# EAGLE schematic tracker (EAGLE 6.5.0)
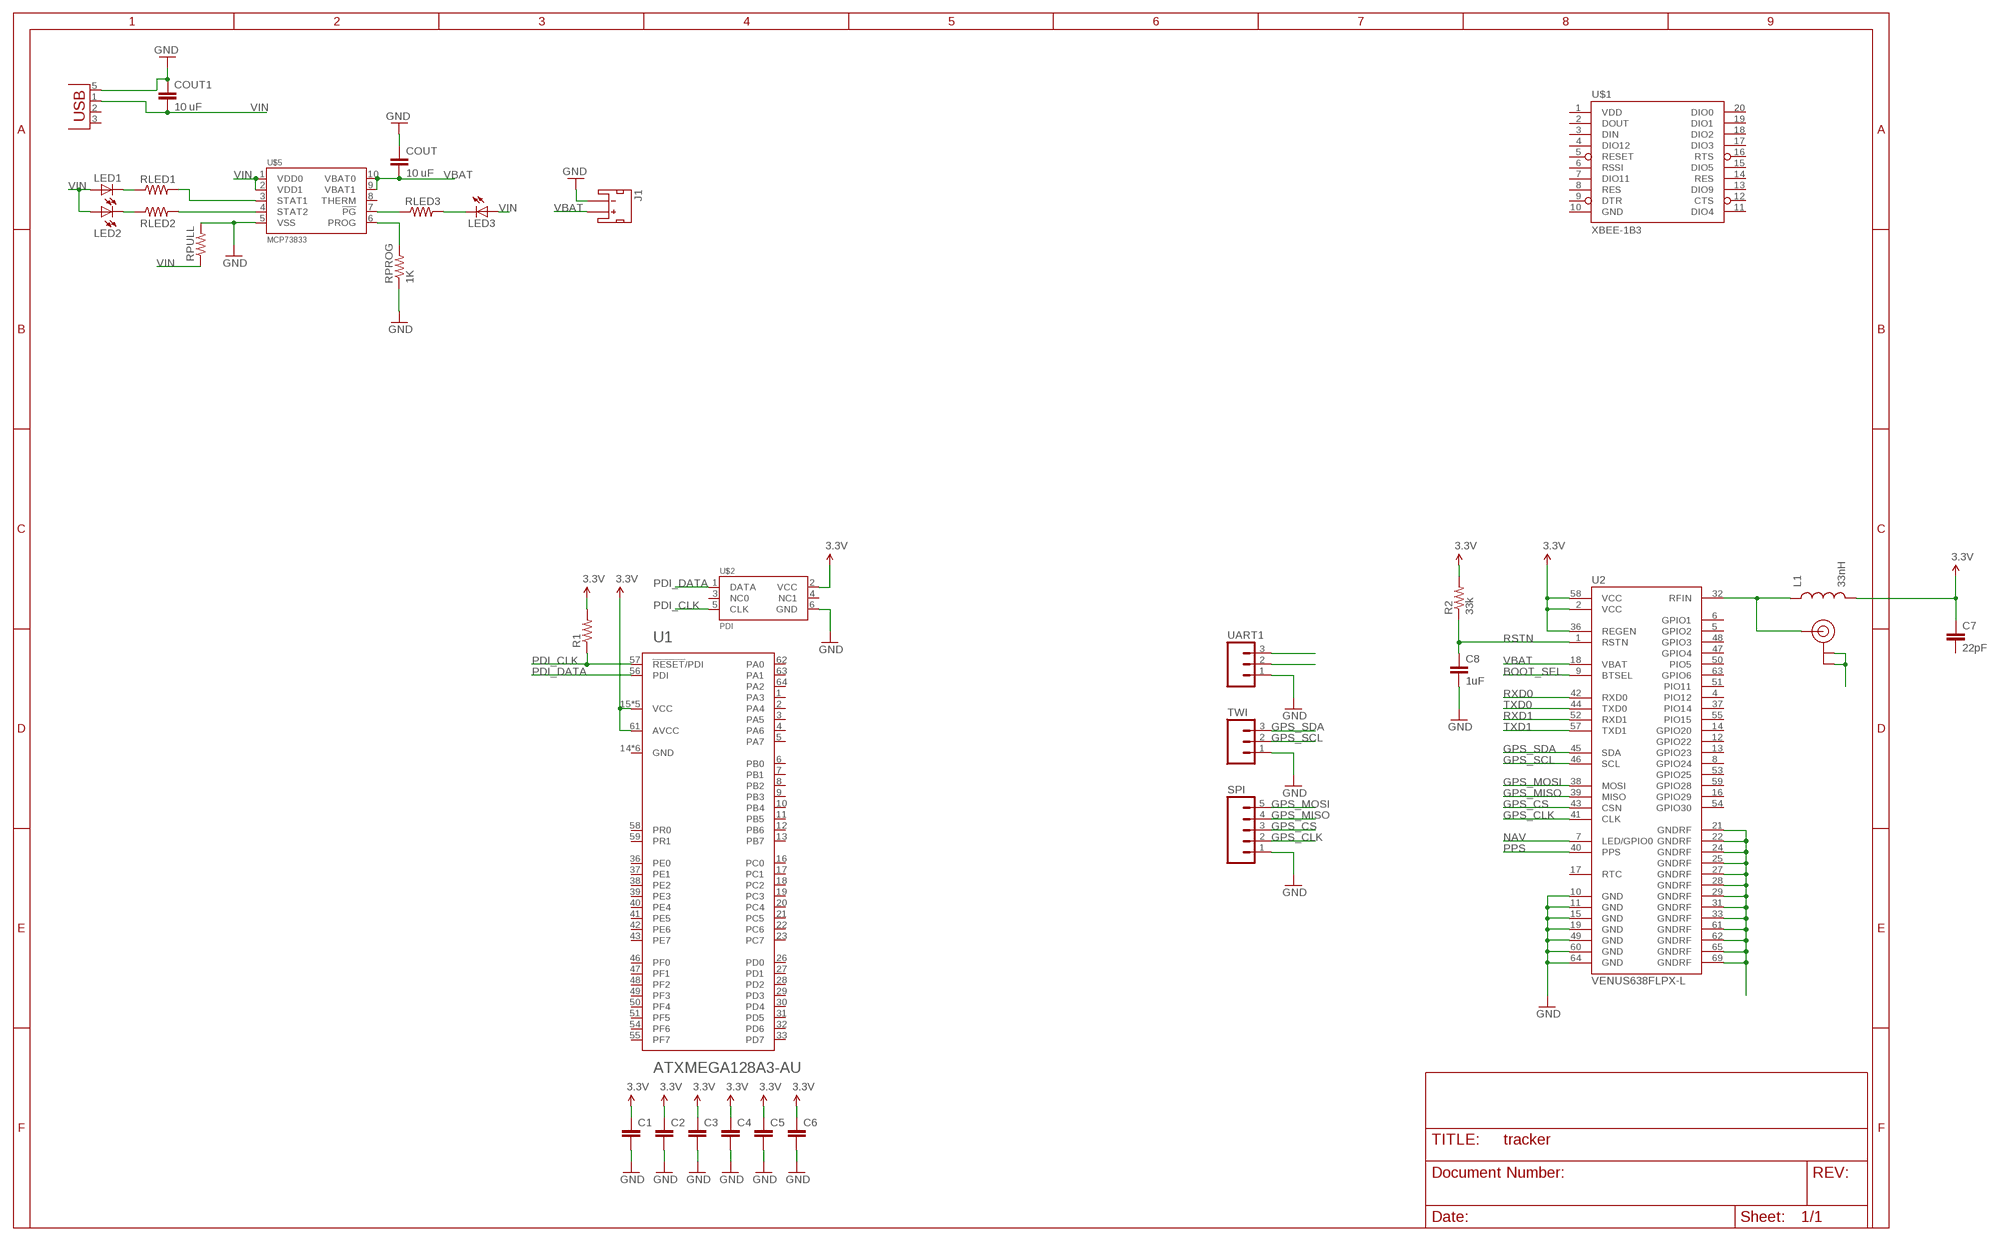
[diagram p0: schematic, sheet 1]

## Parts
C1  CAP0805  [0805]
C2  CAP0805  [0805]
C3  CAP0805  [0805]
C4  CAP0805  [0805]
C5  CAP0805  [0805]
C6  CAP0805  [0805]
C7  22pF  CAP0805  [0805]
C8  1uF  CAP0805  [0805]
COUT  10 uF  CAP0805  [0805]
COUT1  10 uF  CAP0805  [0805]
J1  JST_2MM_MALE  [JST-2-SMD]
L1  33nH  INDUCTOR0805  [0805]
LED1  LEDCHIP-LED0805  [CHIP-LED0805]
LED2  LEDCHIP-LED0805  [CHIP-LED0805]
LED3  LEDCHIP-LED0805  [CHIP-LED0805]
R1  RESISTOR0805-RES  [0805]
R2  33k  RESISTOR0805-RES  [0805]
RLED1  RESISTOR0805-RES  [0805]
RLED2  RESISTOR0805-RES  [0805]
RLED3  RESISTOR0805-RES  [0805]
RPROG  1K  RESISTOR0805-RES  [0805]
RPULL  RESISTOR0805-RES  [0805]
SPI  M05PTH  [1X05]
TWI  M03PTH  [1X03]
U1  ATXMEGA128A3-AU  [TQFP-64A-64]
U2  VENUS638FLPX-L  [VENUS638FLPX]
U$1  XBEE-1B3  [XBEE-SMD]
U$2  PDI  [2X3]
U$3  SL1204  [SL1204]
U$4  USB  [USB_MICRO_B]
U$5  MCP73833  [MSOP10]
UART1  M03PTH  [1X03]

## Nets
3.3V: C1.1 C2.1 C3.1 C4.1 C5.1 C6.1 C7.1 L1.2 R1.2 R2.2 U1.15(VCC) U1.25(VCC) U1.35(VCC) U1.45(VCC) U1.53(VCC) U1.61(AVCC) U2.2(VCC) U2.36(REGEN) U2.58(VCC) U$2.2(VCC)
BOOT_SEL: U2.9(BTSEL)
GND: C1.2 C2.2 C3.2 C4.2 C5.2 C6.2 C8.2 COUT1.1 COUT.1 J1.1(-) RPROG.1 RPULL.2 SPI.1 TWI.1 U2.10(GND) U2.11(GND) U2.15(GND) U2.19(GND) U2.49(GND) U2.60(GND) U2.64(GND) U$2.6(GND) U$4.5(GND) U$5.5(VSS) UART1.1
GPS_CLK: SPI.2 U2.41(CLK)
GPS_CS: SPI.3 U2.43(CSN)
GPS_MISO: SPI.4 U2.39(MISO)
GPS_MOSI: SPI.5 U2.38(MOSI)
GPS_SCL: TWI.2 U2.46(SCL)
GPS_SDA: TWI.3 U2.45(SDA)
N$1: U2.21(GNDRF) U2.22(GNDRF) U2.24(GNDRF) U2.25(GNDRF) U2.27(GNDRF) U2.28(GNDRF) U2.29(GNDRF) U2.31(GNDRF) U2.33(GNDRF) U2.61(GNDRF) U2.62(GNDRF) U2.65(GNDRF) U2.69(GNDRF)
N$2: UART1.3
N$3: RLED3.1 U$5.7(!PG)
N$4: RLED2.2 U$5.4(STAT2)
N$5: RLED1.2 U$5.3(STAT1)
N$6: LED1.C RLED1.1
N$7: LED2.C RLED2.1
N$8: LED3.C RLED3.2
N$9: UART1.2
N$10: L1.1 U2.32(RFIN) U$3.2(SIGNAL)
N$11: U$3.1(GND) U$3.3(GND)
N$12: RPROG.2 U$5.6(PROG)
NAV: U2.7(LED/GPIO0)
PDI_CLK: R1.1 U1.57(!RESET!/PDI) U$2.5(CLK)
PDI_DATA: U1.56(PDI) U$2.1(DATA)
PPS: U2.40(PPS)
RSTN: C8.1 R2.1 U2.1(RSTN)
RXD0: U2.42(RXD0)
RXD1: U2.52(RXD1)
TXD0: U2.44(TXD0)
TXD1: U2.57(TXD1)
VBAT: COUT.2 J1.2(+) U2.18(VBAT) U$5.9(VBAT1) U$5.10(VBAT0)
VIN: COUT1.2 LED1.A LED2.A LED3.A RPULL.1 U$4.1(VBUS) U$5.1(VDD0) U$5.2(VDD1)
Unconnected: C7.2 J1.NC1(PAD1) J1.NC2(PAD2) U1.1(PA3) U1.2(PA4) U1.3(PA5) U1.4(PA6) U1.5(PA7) U1.6(PB0) U1.7(PB1) U1.8(PB2) U1.9(PB3) U1.10(PB4) U1.11(PB5) U1.12(PB6) U1.13(PB7) U1.16(PC0) U1.17(PC1) U1.18(PC2) U1.19(PC3) U1.20(PC4) U1.21(PC5) U1.22(PC6) U1.23(PC7) U1.26(PD0) U1.27(PD1) U1.28(PD2) U1.29(PD3) U1.30(PD4) U1.31(PD5) U1.32(PD6) U1.33(PD7) U1.36(PE0) U1.37(PE1) U1.38(PE2) U1.39(PE3) U1.40(PE4) U1.41(PE5) U1.42(PE6) U1.43(PE7) U1.46(PF0) U1.47(PF1) U1.48(PF2) U1.49(PF3) U1.50(PF4) U1.51(PF5) U1.54(PF6) U1.55(PF7) U1.58(PR0) U1.59(PR1) U1.62(PA0) U1.63(PA1) U1.64(PA2) U2.4(PIO12) U2.5(GPIO2) U2.6(GPIO1) U2.8(GPIO24) U2.12(GPIO22) U2.13(GPIO23) U2.14(GPIO20) U2.16(GPIO29) U2.17(RTC) U2.37(PIO14) U2.47(GPIO4) U2.48(GPIO3) U2.50(PIO5) U2.51(PIO11) U2.53(GPIO25) U2.54(GPIO30) U2.55(PIO15) U2.59(GPIO28) U2.63(GPIO6) U$1.2(DOUT) U$1.3(DIN) U$1.4(DIO12) U$1.5(RESET) U$1.6(RSSI) U$1.7(DIO11) U$1.8(RES) U$1.9(DTR) U$1.11(DIO4) U$1.12(CTS) U$1.13(DIO9) U$1.14(RES) U$1.15(DIO5) U$1.16(RTS) U$1.17(DIO3) U$1.18(DIO2) U$1.19(DIO1) U$1.20(DIO0) U$2.3(NC0) U$2.4(NC1) U$4.2(D-) U$4.3(D+) U$5.8(THERM)

## Power pins joined to a net without a drawn wire
GND: U1.14(GND) U1.24(GND) U1.34(GND) U1.44(GND) U1.52(GND) U1.60(GND) U$1.10(GND)
VDD: U$1.1(VDD)

## Library data of the parts
C1-C8 COUT COUT1 = SparkFun:CAP: Capacitor Standard 0603 ceramic capacitor, and 0.1" leaded capacitor.
J1 = SparkFun-Connectors:JST_2MM_MALE: Mates to single-cell LiPo batteries. CONN-08352; PROD_ID: CONN-08352
L1 = SparkFun:INDUCTOR: Inductors Basic Inductor/Choke - 0603 and 1206. Footprints are not proven and vary greatly between part numbers.
LED1-LED3 = led:LED: LED OSRAM: - CHIPLED LG R971, LG N971, LY N971, LG Q971, LY Q971, LO R971, LY R971 LH N974, LH R974 LS Q976, LO Q976, LY Q976 LO Q996 - Hyper CHIPLED LW Q18S LB Q993, LB Q99A, LB R99A - SideLED LS A670, LO A670, LY A670, LG A670, LP A670 LB A673, LV A673, LT A673, LW A673 LH A674 LY A675 LS A676, LA A676, LO A676, LY A676, LW A676 LS A679, LY A679, LG A679 - Hyper Micro SIDELED® LS Y876, LA Y876, LO Y876, LY Y876 LT Y87S - SmartLED LW L88C, LW L88S LB L89C, LB L89S, LG L890 LS L89K, LO L89K, LY L89K LS L896, LA L896, LO L896, LY L896 - TOPLED LS T670, LO T670, LY T670, LG T670, LP T670 LSG T670, LSP T670, LSY T670, LOP T670, LYG T670 LG T671, LOG T671, LSG T671 LB T673, LV T673, LT T673, LW T673 LH T674 LS T676, LA T676, LO T676, LY T676, LB T676, LH T676, LSB T676, LW T676 LB T67C, LV T67C, LT T67C, LS T67K, LO T67K, LY T67K, LW E67C LS E67B, LA E67B, LO E67B, LY E67B, LB E67C, LV E67C, LT E67C LW T67C LS T679, LY T679, LG T679 LS T770, LO T770, LY T770, LG T770, LP T770 LB T773, LV T773, LT T773, LW T773 LH T774 LS E675, LA E675, LY E675, LS T675 LS T776, LA T776, LO T776, LY T776, LB T776 LHGB T686 LT T68C, LB T68C - Hyper Mini TOPLED® LB M676 - Mini TOPLED Santana® LG M470 LS M47K, LO M47K, LY M47K Source: http://www.osram.convergy.de LUXEON: - LUMILED® LXK2-PW12-R00, LXK2-PW12-S00, LXK2-PW14-U00, LXK2-PW14-V00 LXK2-PM12-R00, LXK2-PM12-S00, LXK2-PM14-U00 LXK2-PE12-Q00, LXK2-PE12-R00, LXK2-PE12-S00, LXK2-PE14-T00, LXK2-PE14-U00 LXK2-PB12-K00, LXK2-PB12-L00, LXK2-PB12-M00, LXK2-PB14-N00, LXK2-PB14-P00, LXK2-PB14-Q00 LXK2-PR12-L00, LXK2-PR12-M00, LXK2-PR14-Q00, LXK2-PR14-R00 LXK2-PD12-Q00, LXK2-PD12-R00, LXK2-PD12-S00 LXK2-PH12-R00, LXK2-PH12-S00 LXK2-PL12-P00, LXK2-PL12-Q00, LXK2-PL12-R00 Source: www.luxeon.com KINGBRIGHT: KA-3528ASYC Source: www.kingbright.com
R1 R2 RLED1-RLED3 RPROG RPULL = SparkFun:RESISTOR: Resistor Basic schematic elements and footprints for 0603, 1206, and PTH resistors.
SPI = SparkFun:M05: Header 5 Standard 5-pin 0.1" header. Use with straight break away headers (SKU : PRT-00116), right angle break away headers (PRT-00553), swiss pins (PRT-00743), machine pins (PRT-00117), and female headers (PRT-00115). Molex polarized connector foot print use with SKU : PRT-08230 with associated crimp pins and housings.
TWI UART1 = SparkFun:M03: Header 3 Standard 3-pin 0.1" header. Use with straight break away headers (SKU : PRT-00116), right angle break away headers (PRT-00553), swiss pins (PRT-00743), machine pins (PRT-00117), and female headers (PRT-00115). Molex polarized connector foot print use with SKU : PRT-08232 with associated crimp pins and housings.
U1 = atmel-xmega:ATXMEGA128A3: 8/16-bit XMEGA A3 Microcontroller Features High-performance, Low-power 8/16-bit Atmel® AVR® XMEGATM Microcontroller Non-volatile Program and Data Memories – 64 KB - 256 KB of In-System Self-Programmable Flash – 4 KB - 8 KB Boot Code Section with Independent Lock Bits – 2 KB - 4 KB EEPROM – 4 KB - 16 KB Internal SRAM Peripheral Features – Four-channel DMA Controller with support for external requests – Eight-channel Event System – Seven 16-bit Timer/Counters Four Timer/Counters with 4 Output Compare or Input Capture channels Three Timer/Counters with 2 Output Compare or Input Capture channels High Resolution Extensions on all Timer/Counters Advanced Waveform Extension on one Timer/Counter – Seven USARTs IrDA Extension on 1 USART – AES and DES Crypto Engine – Two Two-wire Interfaces with dual address match (I2C and SMBus compatible) – Three SPI (Serial Peripheral Interfaces) – 16-bit Real Time Counter with Separate Oscillator – Two Eight-channel, 12-bit, 2 Msps Analog to Digital Converters – One Two-channel, 12-bit, 1 Msps Digital to Analog Converter – Four Analog Comparators with Window compare function – External Interrupts on all General Purpose I/O pins – Programmable Watchdog Timer with Separate On-chip Ultra Low Power Oscillator Special Microcontroller Features – Power-on Reset and Programmable Brown-out Detection – Internal and External Clock Options with PLL – Programmable Multi-level Interrupt Controller – Sleep Modes: Idle, Power-down, Standby, Power-save, Extended Standby – Advanced Programming, Test and Debugging Interfaces JTAG (IEEE 1149.1 Compliant) Interface for test, debug and programming PDI (Program and Debug Interface) for programming, test and debugging I/O and Packages – 50 Programmable I/O Lines – 64-lead TQFP – 64-pad QFN Operating Voltage – 1.6 – 3.6V Speed performance – 0 – 12 MHz @ 1.6 – 3.6V – 0 – 32 MHz @ 2.7 – 3.6V
U2 = SparkFun:VENUS638FLPX-L: Venus638FLPX-L GPS Receiver Venus638FLPx is a high performance, low cost, single chip GPS receiver targeting mobile consumer and cellular handset applications. It offers very low power consumption, high sensitivity, and best in class signal acquisition and time-to-first-fix performance. Venus638FLPx contains all the necessary components of a complete GPS receiver, includes 1.2dB cascaded system NF RF front-end, GPS baseband signal processor, 0.5ppm TCXO, 32.768kHz RTC crystal, RTC LDO regulator, and passive components. It requires very low external component count and takes up only 100mm2 PCB footprint. Dedicated massive-correlator signal parameter search engine within the baseband enables rapid search of all the available satellites and acquisition of very weak signal. An advanced track engine allows weak signal tracking and positioning in harsh environments such as urban canyons and under deep foliage. The self-contained architecture keeps GPS processing off the host and allows integration into applications with very little resource. FEATURES 20Hz update rate -148dBm cold start sensitivity -165dBm tracking sensitivity 29 second cold start TTFF 3.5 second TTFF with AGPS 1 second hot start 2.5m accuracy Multipath detection and suppression Jamming detection and mitigation SBAS (WAAS / EGNOS) support 7-day extended ephemeris AGPS 67mW full power navigation Works directly with active or passive antenna Internal flash for optional 75K point data logging Supports external SPI flash memory data logging Complete receiver in 10mm x 10mm x 1.3mm size Contains LNA, SAW Filter, TCXO, RTC Xtal, LDO Pb-free RoHS compliant
U$1 = SparkFun:XBEE-1
U$2 = rocket:PDI
U$3 = rocket:SL1204
U$4 = rocket:USB
U$5 = rocket:MCP73833